# EAGLE design HaD Arduino (EAGLE 6.3)
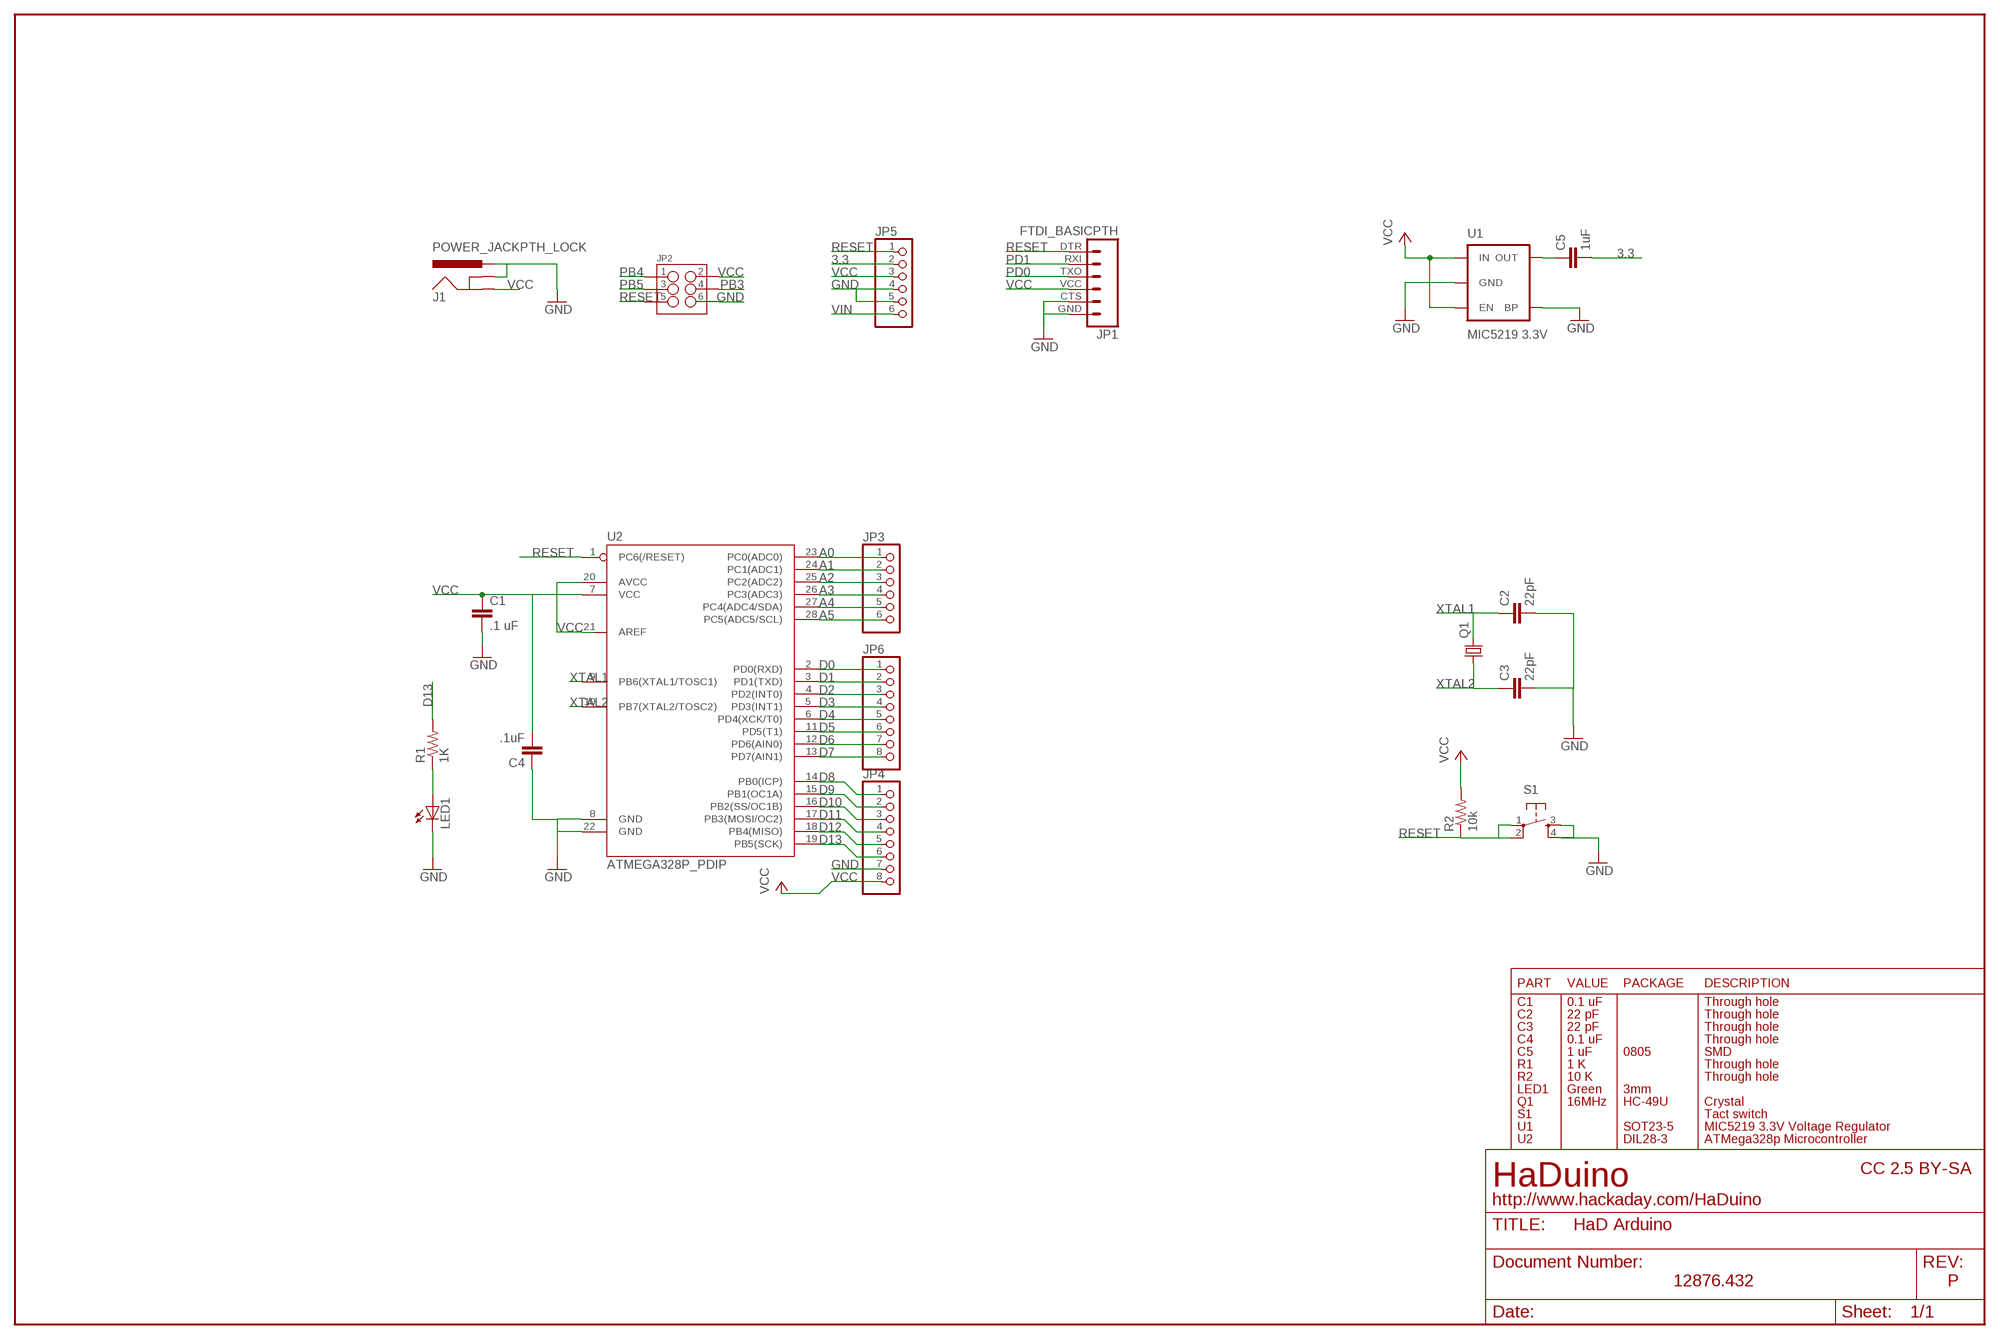
[diagram p0: schematic, sheet 1]

## Parts
C1  .1 uF  CAPKIT  [CAP-PTH-SMALL-KIT]
C2  22pF  CAPKIT  [CAP-PTH-SMALL-KIT]
C3  22pF  CAPKIT  [CAP-PTH-SMALL-KIT]
C4  .1uF  CAPKIT  [CAP-PTH-SMALL-KIT]
C5  1uF  1UF-25V-10%(0805)  [0805]
J1  POWER_JACKPTH_LOCK  [POWER_JACK_PTH_LOCK]
JP1  FTDI_BASICPTH  [FTDI_BASIC]
JP2  M03X2POGO_PINS  [2X3_POGO]
JP3  PINHD-1X6B  [1X06-BIG]
JP4  PINHD-1X8BIG  [1X08-BIG]
JP5  PINHD-1X6B  [1X06-BIG]
JP6  PINHD-1X8BIG  [1X08-BIG]
LED1  LED3MM  [LED3MM]
Q1  CRYTALHC49U-V  [HC49U-V]
R1  1K  RESISTORKIT  [AXIAL-0.3-KIT]
R2  10k  RESISTORKIT  [AXIAL-0.3-KIT]
S1  TAC_SWITCHPTH  [TACTILE-PTH]
U1  MIC5219 3.3V  V_REG_MIC52193.3V  [SOT23-5]
U2  ATMEGA328P_PDIP  [DIL28-3]

## Nets
3.3: C5.2 JP5.2
A0: JP3.1 U2.23(PC0(ADC0))
A1: JP3.2 U2.24(PC1(ADC1))
A2: JP3.3 U2.25(PC2(ADC2))
A3: JP3.4 U2.26(PC3(ADC3))
A4: JP3.5 U2.27(PC4(ADC4/SDA))
A5: JP3.6 U2.28(PC5(ADC5/SCL))
D0: JP6.1 U2.2(PD0(RXD))
D1: JP6.2 U2.3(PD1(TXD))
D2: JP6.3 U2.4(PD2(INT0))
D3: JP6.4 U2.5(PD3(INT1))
D4: JP6.5 U2.6(PD4(XCK/T0))
D5: JP6.6 U2.11(PD5(T1))
D6: JP6.7 U2.12(PD6(AIN0))
D7: JP6.8 U2.13(PD7(AIN1))
D8: JP4.1 U2.14(PB0(ICP))
D9: JP4.2 U2.15(PB1(OC1A))
D10: JP4.3 U2.16(PB2(SS/OC1B))
D11: JP4.4 U2.17(PB3(MOSI/OC2))
D12: JP4.5 U2.18(PB4(MISO))
D13: JP4.6 R1.P$2 U2.19(PB5(SCK))
GND: C1.2 C2.2 C3.2 C4.1 J1.GNDBREAK J1.PWR JP1.CTS JP1.GND JP2.P$6 JP4.7 JP5.4 JP5.5 LED1.K(C) S1.3 S1.4 U1.2(GND) U1.4(BP) U2.8(GND) U2.22(GND)
N$1: LED1.A R1.P$1
N$6: C5.1 U1.5(OUT)
PB3: JP2.P$4
PB4: JP2.P$1
PB5: JP2.P$3
PD0: JP1.TXO
PD1: JP1.RXI
RESET: JP1.DTR JP2.P$5 JP5.1 R2.P$1 S1.1 S1.2 U2.1(PC6(/RESET))
VCC: C1.1 C4.2 J1.GND JP1.VCC JP2.P$2 JP4.8 JP5.3 R2.P$2 U1.1(IN) U1.3(EN) U2.7(VCC) U2.20(AVCC) U2.21(AREF)
VIN: JP5.6
XTAL1: C2.1 Q1.2 U2.9(PB6(XTAL1/TOSC1))
XTAL2: C3.1 Q1.1 U2.10(PB7(XTAL2/TOSC2))

## Notes on the sheet
- PART | VALUE | PACKAGE | DESCRIPTION
- C1 | 0.1 uF | Through hole
- C2 | 22 pF | Through hole
- C3 | 22 pF | Through hole
- C4 | 0.1 uF | Through hole
- C5 | 1 uF | 0805 | SMD
- R1 | 1 K | Through hole
- R2 | 10 K | Through hole
- LED1 | Green | 3mm
- Q1 | 16MHz | HC-49U | Crystal
- S1 | Tact switch
- U1 | SOT23-5 | MIC5219 3.3V Voltage Regulator
- U2 | DIL28-3 | ATMega328p Microcontroller
- CC 2.5 BY-SA
- HaDuino
- http://www.hackaday.com/HaDuino
- 12876.432 | P

## Library data of the parts
C1-C4 = SparkFun-Capacitors:CAP: Capacitor Standard 0603 ceramic capacitor, and 0.1" leaded capacitor.
C5 = SparkFun-Capacitors:1UF-25V-10%(0805): CAP-08064; PROD_ID: CAP-08064
J1 = SparkFun-Connectors:POWER_JACK: Power Jack This is the standard 5.5mm barrel jack for power. The PTH is the most common, proven, reliable, footprint. The Slot footprint only works if the mill layer is transmitted to the PCB fab house so be warned. Spark Fun Electronics SKU : PRT-00119 SMT: CONN-08106 Mating wall wart : TOL-00298 (and others)
JP1 = SparkFun-Connectors:FTDI_BASIC: FTDI Basic header with labels
JP2 = SparkFun-Connectors:M03X2: 2x3 .1" header. Shrouded, with keying- CONN-10681 SMT- CONN-11415 Pogo pins- HW-11044; PROD_ID: HW-11044
JP3 JP5 = adafruit:PINHD-1X6: PIN HEADER
JP4 JP6 = adafruit:PINHD-1X8: PIN HEADER
LED1 = adafruit:LED: LED OSRAM: - CHIPLED LG R971, LG N971, LY N971, LG Q971, LY Q971, LO R971, LY R971 LH N974, LH R974 LS Q976, LO Q976, LY Q976 LO Q996 - Hyper CHIPLED LW Q18S LB Q993, LB Q99A, LB R99A - SideLED LS A670, LO A670, LY A670, LG A670, LP A670 LB A673, LV A673, LT A673, LW A673 LH A674 LY A675 LS A676, LA A676, LO A676, LY A676, LW A676 LS A679, LY A679, LG A679 - Hyper Micro SIDELED® LS Y876, LA Y876, LO Y876, LY Y876 LT Y87S - SmartLED LW L88C, LW L88S LB L89C, LB L89S, LG L890 LS L89K, LO L89K, LY L89K LS L896, LA L896, LO L896, LY L896 - TOPLED LS T670, LO T670, LY T670, LG T670, LP T670 LSG T670, LSP T670, LSY T670, LOP T670, LYG T670 LG T671, LOG T671, LSG T671 LB T673, LV T673, LT T673, LW T673 LH T674 LS T676, LA T676, LO T676, LY T676, LB T676, LH T676, LSB T676, LW T676 LB T67C, LV T67C, LT T67C, LS T67K, LO T67K, LY T67K, LW E67C LS E67B, LA E67B, LO E67B, LY E67B, LB E67C, LV E67C, LT E67C LW T67C LS T679, LY T679, LG T679 LS T770, LO T770, LY T770, LG T770, LP T770 LB T773, LV T773, LT T773, LW T773 LH T774 LS E675, LA E675, LY E675, LS T675 LS T776, LA T776, LO T776, LY T776, LB T776 LHGB T686 LT T68C, LB T68C - Hyper Mini TOPLED® LB M676 - Mini TOPLED Santana® LG M470 LS M47K, LO M47K, LY M47K Source: http://www.osram.convergy.de/
Q1 = crystal:CRYTAL: CRYSTAL
R1 = SparkFun-Passives:RESISTOR: Resistor Basic schematic elements and footprints for 0603, 1206, and PTH resistors.
R2 = SparkFun-Resistors:RESISTOR: Resistor Basic schematic elements and footprints for 0603, 1206, and PTH resistors.
S1 = SparkFun-Electromechanical:TAC_SWITCH: Momentary Switch Button commonly used for reset or general input. Spark Fun Electronics SKU : COM-00097 SMT- SWCH-08247
U1 = SparkFun-PowerIC:V_REG_MIC5219: V_REG MIC5219 Standard 500mA LDO voltage regulator in SOT-23 layout. Micrel part MIC5219. BP (by-pass) pin is used to lower output noise with 470pF cap, may be left open.; PROD_ID: VREG-09872
U2 = SparkFun-DigitalIC:ATMEGA328P_PDIP: uC used in the Arduino 32kb flash, 1k EEPROM, 2k SRAM This is the through-hole version of this chip.

## Board
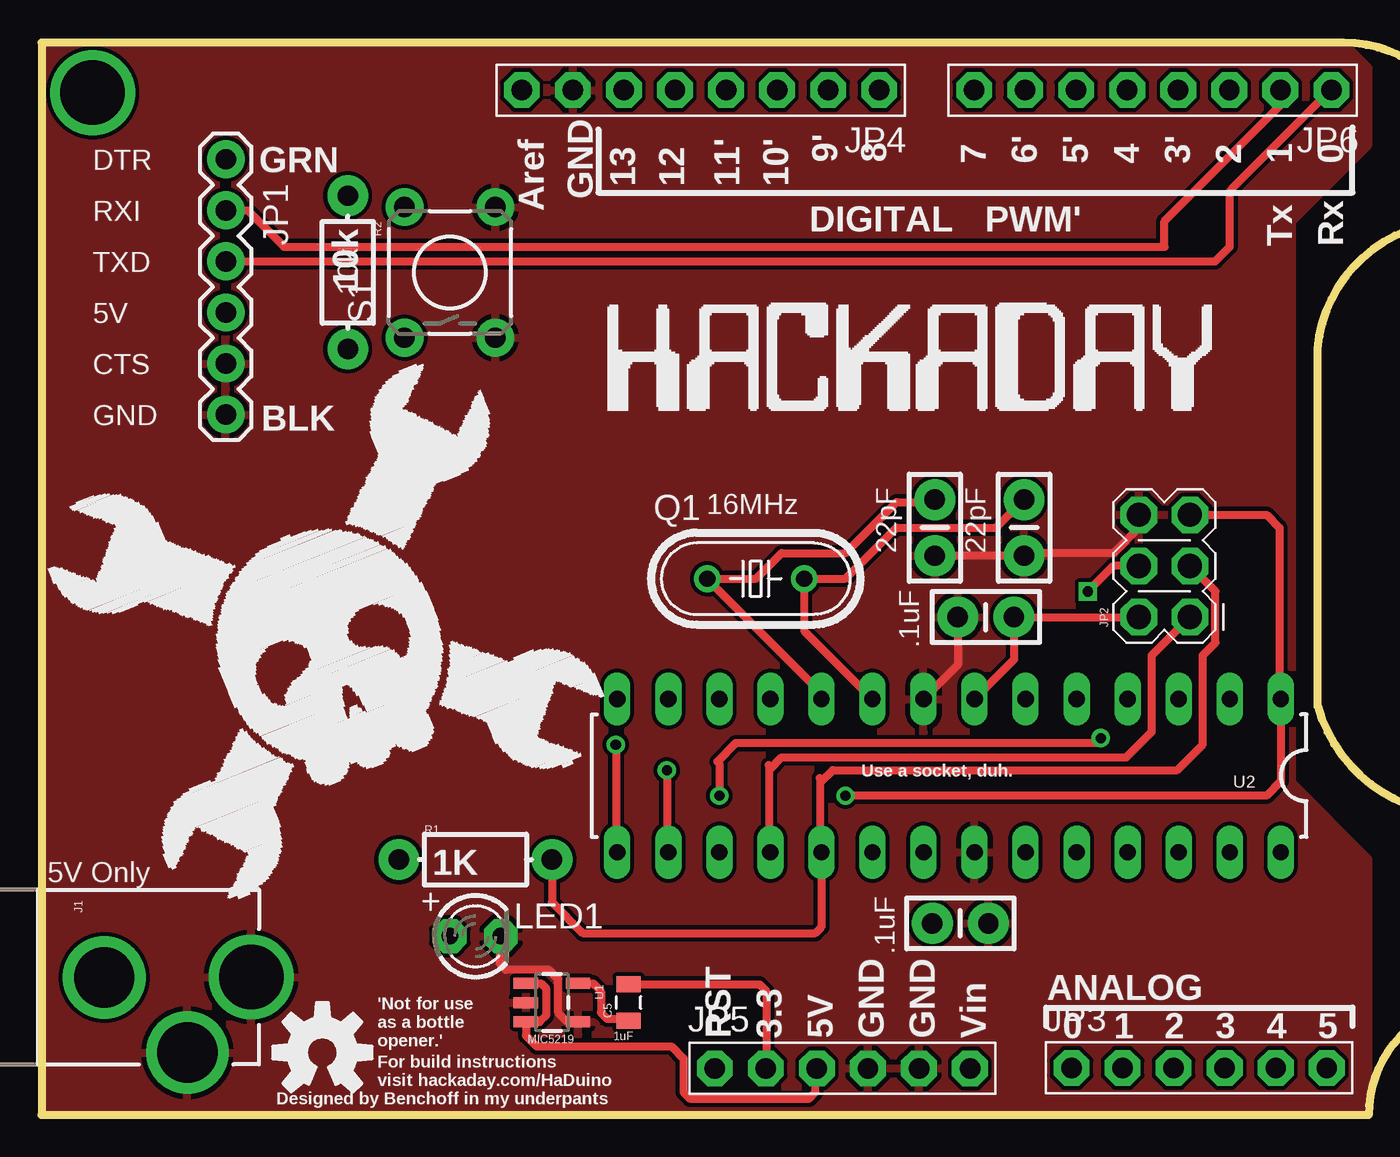
[diagram p1: board, top side]
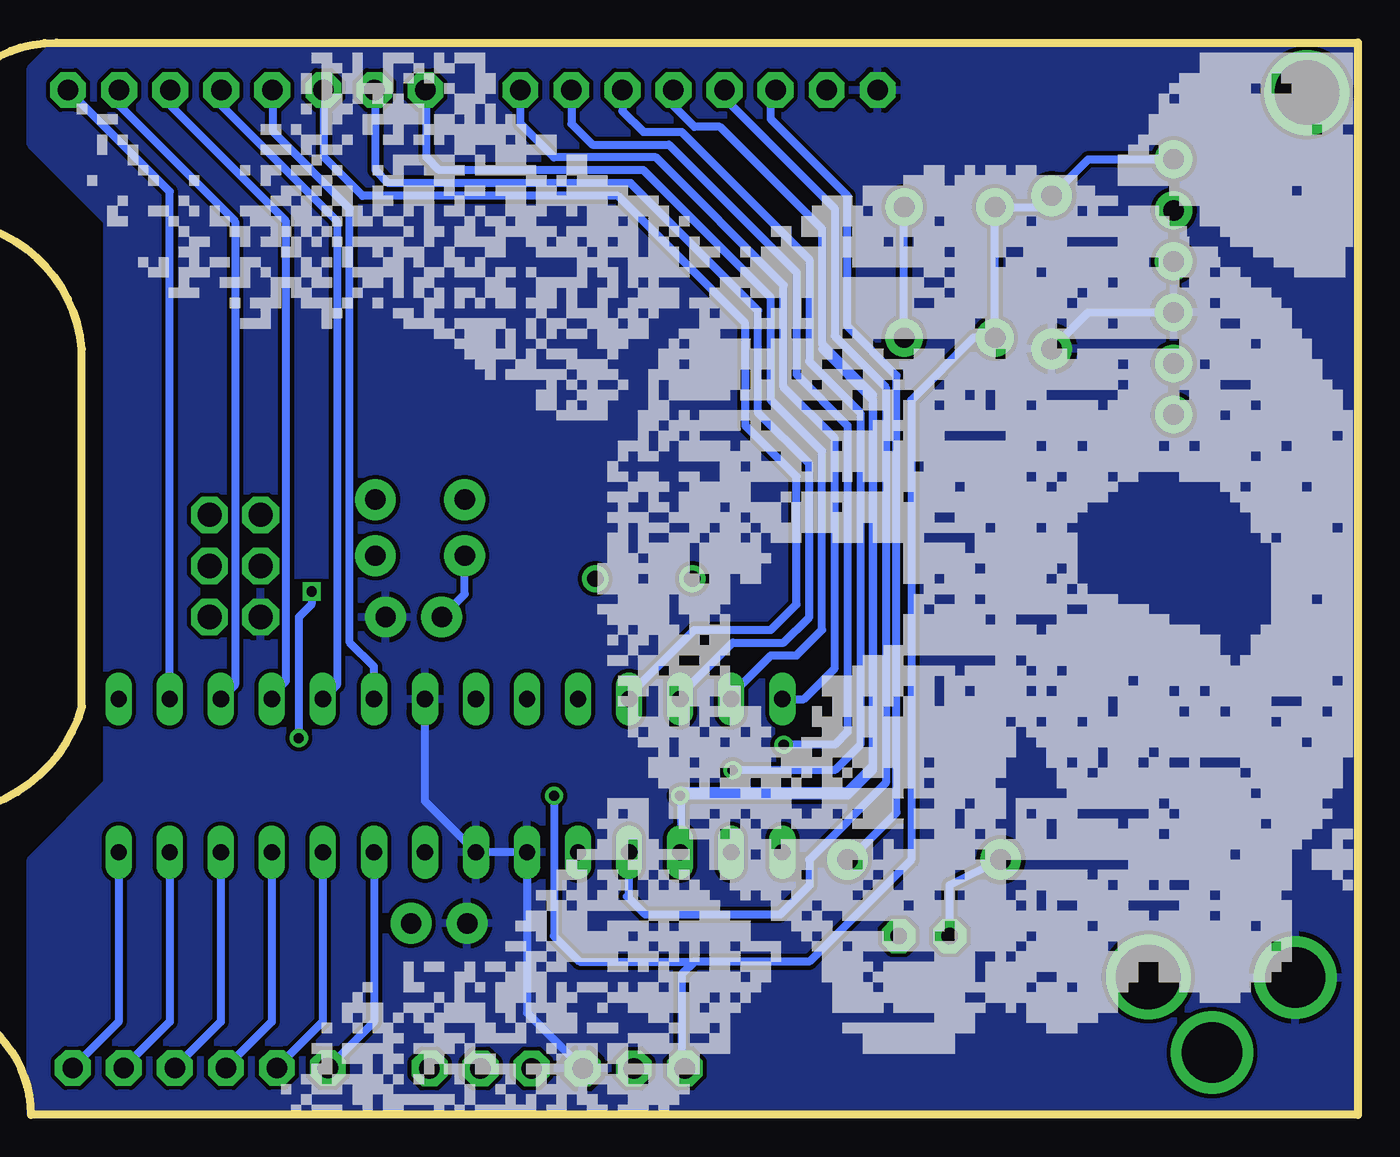
[diagram p2: board, bottom side, seen from below]

No outline drawn. Coordinates in mm, seen from the top.
Copper layers (1*16): Top 0.035mm / dielectric 1.5mm / Bottom 0.035mm
Design rules "default": minimum track width 10mil, minimum drill 24mil, track to track 8mil, track to pad 8mil, pad to pad 8mil, via to via 8mil, smd to smd 8mil, copper to edge 40mil, drill to drill 8mil, minimum pad ring 10mil, minimum via ring 8mil, stop-mask expansion 4mil, vias tented up to drill 0mil, thermal gap 10mil
Milling: 14 lines

### Footprints (pad centres in the part's own frame; a part is rotated, then mirrored left to right if it is on the bottom)
CAP-PTH-SMALL-KIT = drill 1.016 pad 2.032: 1 -1.397,0; 2 1.397,0
0805 = smd 0.8 x 1.2: 1 -0.9,0; 2 0.9,0
POWER_JACK_PTH_LOCK = drill 2.997 pad 4.115: GND 0.025,6.557; GNDBREAK 3.762,10.7 | drill 3.2 pad 4.115: PWR 0,13.878
FTDI_BASIC = drill 1.016 pad 1.88: CTS 10.16,0; DTR 0,0; GND 12.7,0; RXI 2.54,0; TXO 5.08,0; VCC 7.62,0
2X3_POGO = drill 1.2 pad 1.829 octagon: P$1 0,0; P$2 0,2.54; P$3 2.54,0; P$4 2.54,2.54; P$5 5.08,0; P$6 5.08,2.54
1X06-BIG = drill 1.016 pad 1.778 octagon: 1 -6.35,0; 2 -3.81,0; 3 -1.27,0; 4 1.27,0; 5 3.81,0; 6 6.35,0
1X08-BIG = drill 1.016 pad 1.778 octagon: 1 -8.89,0; 2 -6.35,0; 3 -3.81,0; 4 -1.27,0; 5 1.27,0; 6 3.81,0; 7 6.35,0; 8 8.89,0
LED3MM = drill 0.813 pad 1.676 octagon: A -1.27,0; K 1.27,0
HC49U-V = drill 0.813: 1 -2.413,0; 2 2.413,0
AXIAL-0.3-KIT = drill 1.016 pad 2.032: P$1 -3.81,0; P$2 3.81,0
TACTILE-PTH = drill 1.016 pad 1.88: 1 -3.251,2.261; 2 3.251,2.261; 3 -3.251,-2.261; 4 3.251,-2.261
SOT23-5 = smd 0.55 x 1.2: 1 -0.95,-1.3; 2 0,-1.3; 3 0.95,-1.3; 4 0.95,1.3; 5 -0.95,1.3
DIL28-3 = drill 0.813 long: 1 -16.51,-3.81; 2 -13.97,-3.81; 3 -11.43,-3.81; 4 -8.89,-3.81; 5 -6.35,-3.81; 6 -3.81,-3.81; 7 -1.27,-3.81; 8 1.27,-3.81; 9 3.81,-3.81; 10 6.35,-3.81; 11 8.89,-3.81; 12 11.43,-3.81; 13 13.97,-3.81; 14 16.51,-3.81; 15 16.51,3.81; 16 13.97,3.81; 17 11.43,3.81; 18 8.89,3.81; 19 6.35,3.81; 20 3.81,3.81; 21 1.27,3.81; 22 -1.27,3.81; 23 -3.81,3.81; 24 -6.35,3.81; 25 -8.89,3.81; 26 -11.43,3.81; 27 -13.97,3.81; 28 -16.51,3.81

### Placement (x,y rotation side)
C1  48.26,26.8 180 top
C2  50.16,31.24 270 top
C3  45.72,31.24 270 top
C4  46.99,11.56 180 top
C5  30.48,7.62 90 top
J1  -2.17,8.89 270 top
JP1  10.44,49.57 270 top
JP2  58.42,26.8 90 top
JP3  58.88,4.37 0 top
JP4  34.06,53.01 180 top
JP5  41.12,4.34 0 top
JP6  56.57,53.01 180 top
LED1  22.86,10.92 0 top
Q1  36.8,28.7 0 top
R1  22.86,14.73 0 top
R2  16.51,43.94 270 top
S1  21.59,43.94 90 top
U1  26.67,7.62 270 top
U2  46.43,18.91 180 top
U$1  [OSHW-LOGO-M]  15.24,5.13 0 top

### Tracks (layer width: path | path; a pad name or v marks a point on that pad's centre or on a via)
3.3
  Top 0.406: C5.2 37,8.52 37.34,8.18 37.34,4.37 JP5.2
A0
  Bottom 0.406: U2.23 50.24,6.66 JP3.1
A1
  Bottom 0.406: U2.24 52.78,6.66 JP3.2
A2
  Bottom 0.406: U2.25 55.32,6.66 JP3.3
A3
  Bottom 0.406: U2.26 57.86,6.66 JP3.4
A4
  Bottom 0.406: U2.27 60.4,6.66 JP3.5
A5
  Bottom 0.406: U2.28 62.94,6.66 JP3.6
D0
  Bottom 0.406: U2.2 60.4,47.95 JP6.1
D1
  Bottom 0.406: JP6.2 62.92,52.25 57.15,46.48 57.15,23.42 U2.3
D2
  Bottom 0.406: U2.4 55.32,22.91 54.61,23.62 54.61,46.48 60.33,52.2 60.33,52.96 JP6.3
D3
  Bottom 0.406: JP6.4 57.84,52.25 52.07,46.48 52.07,23.42 U2.5
D4
  Bottom 0.406: U2.6 50.24,24.33 51.44,25.53 51.44,47.12 55.24,50.93 55.24,52.96 JP6.5
D5
  Bottom 0.406: U2.11 37.54,22.91 34.29,26.16 30.48,26.16 29.21,27.43 29.21,33.78 31.75,36.32 31.75,41.4 38.1,47.75 50.8,47.75 52.7,49.66 52.7,52.96 JP6.6
D6
  Bottom 0.406: U2.12 35,22.91 32.38,25.53 29.84,25.53 28.57,26.8 28.57,34.42 31.11,36.96 31.11,42.04 37.47,48.39 49.53,48.39 50.16,49.02 50.16,52.96 JP6.7
D7
  Bottom 0.406: U2.13 32.46,22.91 30.48,24.89 29.21,24.89 27.94,26.16 27.94,35.05 30.48,37.59 30.48,42.67 36.83,49.02 46.99,49.02 47.62,49.66 47.62,52.96 JP6.8
D8
  Bottom 0.406: U2.14 28.85,22.72 27.3,24.26 27.3,35.69 29.84,38.23 29.84,43.31 36.2,49.66 41.27,49.66 42.95,51.33 JP4.1
D9  (via drill 0.5)
  Top 0.406: v29.84,20.45 29.84,15.17 U2.15
  Bottom 0.406: JP4.2 40.41,51.33 39.37,50.29 35.56,50.29 29.21,43.94 29.21,38.86 26.67,36.32 26.67,21.08 27.3,20.45 v29.84,20.45
D10  (via drill 0.5)
  Top 0.406: v32.38,19.18 32.38,15.17 U2.16
  Bottom 0.406: JP4.3 37.87,51.97 36.83,50.93 34.92,50.93 28.57,44.58 28.57,39.5 26.04,36.96 26.04,20.45 27.3,19.18 v32.38,19.18
D11
  Bottom 0.406: U2.17 34.92,15.17 34.92,18.16 26.67,18.16 25.4,19.43 25.4,37.85 27.94,40.39 27.94,46.1 33.02,51.18 34.29,51.18 35.56,52.45 35.56,52.78 JP4.4
D12
  Bottom 0.406: U2.18 37.54,12.9 37.64,12.9 36.73,11.99 30.02,11.99 28.56,13.45 28.57,13.46 28.57,14.73 24.77,18.54 24.77,38.23 27.3,40.77 27.3,47.12 32.79,52.6 JP4.5
D13
  Top 0.406: R1.P$2 26.67,12.6 28.19,11.07 39.78,11.07 40.08,11.38 U2.19
  Bottom 0.406: JP4.6 30.43,52.83 30.48,52.83 30.48,51.56 26.67,47.75 26.67,41.25 24.23,38.81 24.23,17.07 26.57,14.73 R1.P$2
GND
  Top 0.406: C1.2 46.86,24.42 U2.8 | C3.2 C2.2 50.29,29.97 54.61,29.97 55.88,31.24 JP2.P$6 | U1.4 27.42,6.67 26.98,7.11 26.98,8.79 26.52,9.25 24.38,9.25 24.08,9.55 24.08,10.87 LED1.K
  Bottom 0.406: 23.85,40.49 S1.3 S1.4 | C1.2 45.72,27.94 C3.2
  pour Top: 1.27,55.37 1.27,2.03 67.31,2.03 67.31,14.73 63.5,18.54 63.5,46.48 67.31,50.29 67.31,54.1 66.04,55.37
N$1
  Bottom 0.406: R1.P$1 21.59,13.46 LED1.A
N$2
  Top 0.406: 37.47,19.43 37.47,14.99
N$3
  Top 0.406: 40.01,18.8 40.01,14.99
N$4
  Top 0.406: 65.28,52.58 65.28,53.21 65.41,53.34
N$5
  Top 0.406: 65.38,52.98 60.5,48.11
N$6
  Top 0.406: U1.5 28.72,8.57 29.11,8.18 29.11,7.11 29.41,6.81 30.39,6.81 C5.1
N$7  (via drill 3.2)
  other vias: 3.81,52.88
N$8  (via drill 0.5)
  other vias: 53.34,28.07
PB3  (via drill 0.5)
  Top 0.406: JP2.P$4 54.61,29.34 v53.34,28.07 | v53.98,20.78 53.72,20.52 35.81,20.52 34.9,19.61 35,19.51 v35,17.91
  Bottom 0.406: v53.34,28.07 53.34,27.43 53.98,26.8 v53.98,20.78 | 27.94,40.13 25.4,37.59 25.4,19.18 26.67,17.91 v35,17.91
PB4
  Top 0.406: 37.54,19.25 38.1,19.81 55.24,19.81 56.52,21.08 56.52,24.89 JP2.P$1
PB5
  Top 0.406: 40.08,18.61 40.64,19.18 57.78,19.18 59.05,20.45 59.05,24.89 59.69,25.53 59.69,28.07 JP2.P$3
PD0
  Top 0.406: JP1.TXO 59.67,44.49 60.4,45.21 60.4,47.95
PD1
  Top 0.406: JP1.RXI 11.52,47.03 13.34,45.21 57.15,45.21 57.15,46.48 62.87,52.2 62.87,52.96
RESET  (via drill 0.5)
  Top 0.406: JP2.P$5 62.23,31.88 62.87,31.24 62.87,22.79 U2.1 62.94,18.61 62.23,17.91 v41.27,17.91
  Bottom 0.406: JP1.DTR 14.69,49.57 R2.P$1 17.07,47.19 S1.2 S1.1 20.4,40.69 23.5,37.59 23.5,14.73 28.57,9.65 34.29,9.65 | 34.29,9.65 34.92,9.02 34.92,4.5 JP5.1 | v41.27,17.91 41.27,10.92 40.01,9.65 34.29,9.65
VCC
  Top 0.406: U2.7 49.66,24.68 C1.1 JP2.P$2 | JP5.3 39.78,4.27 39.78,3.15 39.47,2.85 33.53,2.85 33.22,3.15 33.22,4.83 32.61,5.44 25.91,5.44 25.37,5.97 U1.3 25.39,6.66 26.06,6.66 26.36,6.96 26.36,8.33 26.13,8.57 U1.1
  Bottom 0.406: JP5.3 42.62,7.11 U2.20 U2.21 47.7,17.64 47.7,18.09 U2.7 | R2.P$2 14.69,41.95 JP1.VCC
  pour Bottom: 1.27,55.37 1.27,2.03 67.31,2.03 67.31,14.73 63.5,18.54 63.5,46.48 67.31,50.29 67.31,54.1 66.04,55.37
XTAL1
  Top 0.406: C2.1 48.77,31.24 43.81,31.24 41.27,28.7 Q1.2 39.22,26.12 U2.9
XTAL2
  Top 0.406: C3.1 45.59,32.51 43.81,32.51 41.27,29.97 38.1,29.97 36.83,28.7 Q1.1 40.08,23.02 U2.10

### Text on the board
tPlace: DTR | GRN | 9' | 8 | 7 | 6' | 5' | 4 | 3' | 2 | 1 | 0 | GND | 13 | 12 | 11' | 10' | Aref | RXI | DIGITAL | PWM' | Tx | Rx | TXD | 10k | 5V | CTS | GND | BLK | 16MHz | 22pF | 22pF | .1uF | Use a socket, duh. | 5V Only | .1uF | ANALOG | MIC5219 | 1uF | RST | 3.3 | 5V | GND | GND | Vin | 0 | 1 | 2 | 3 | 4 | 5 | 'Not for use / as a bottle / opener.' | For build instructions | Designed by Benchoff in my underpants | visit hackaday.com/HaDuino